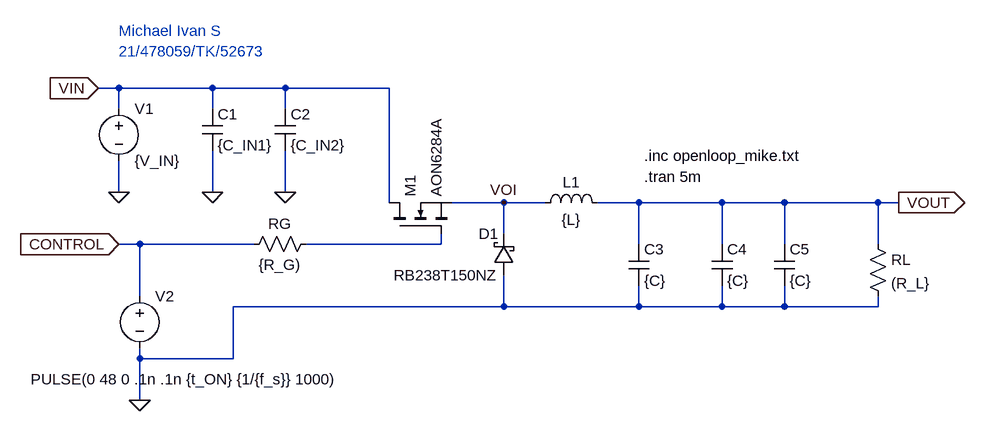
[diagram p0: schematic openloop_mike.asc]
openloop_mike.asc, the LTspice schematic file:
Version 4
SHEET 1 1372 788
WIRE 48 288 16 288
WIRE 192 288 48 288
WIRE 304 288 192 288
WIRE 464 288 304 288
WIRE 48 320 48 288
WIRE 192 320 192 288
WIRE 304 320 304 288
WIRE 48 448 48 400
WIRE 192 448 192 384
WIRE 304 448 304 384
WIRE 464 464 464 288
WIRE 640 464 560 464
WIRE 704 464 640 464
WIRE 848 464 784 464
WIRE 976 464 848 464
WIRE 1072 464 976 464
WIRE 1216 464 1072 464
WIRE 1248 464 1216 464
WIRE 640 512 640 464
WIRE 80 528 48 528
WIRE 256 528 80 528
WIRE 544 528 544 512
WIRE 544 528 336 528
WIRE 848 528 848 464
WIRE 976 528 976 464
WIRE 1072 528 1072 464
WIRE 1216 528 1216 464
WIRE 80 608 80 528
WIRE 640 624 640 576
WIRE 640 624 224 624
WIRE 848 624 848 592
WIRE 848 624 640 624
WIRE 976 624 976 592
WIRE 976 624 848 624
WIRE 1072 624 1072 592
WIRE 1072 624 976 624
WIRE 1216 624 1216 608
WIRE 1216 624 1072 624
WIRE 80 704 80 688
WIRE 224 704 224 624
WIRE 224 704 80 704
WIRE 80 768 80 704
FLAG 80 768 0
FLAG 48 448 0
FLAG 192 448 0
FLAG 304 448 0
FLAG 16 288 VIN
IOPIN 16 288 In
FLAG 48 528 CONTROL
IOPIN 48 528 In
FLAG 1248 464 VOUT
IOPIN 1248 464 Out
FLAG 640 464 VOI
SYMBOL nmos 464 512 R270
SYMATTR InstName M1
SYMATTR Value AON6284A
SYMBOL voltage 48 304 R0
WINDOW 123 0 0 Left 0
WINDOW 39 0 0 Left 0
SYMATTR InstName V1
SYMATTR Value {V_IN}
SYMBOL cap 176 320 R0
SYMATTR InstName C1
SYMATTR Value {C_IN1}
SYMBOL cap 288 320 R0
SYMATTR InstName C2
SYMATTR Value {C_IN2}
SYMBOL res 240 544 R270
WINDOW 0 32 56 VTop 2
WINDOW 3 0 56 VBottom 2
SYMATTR InstName RG
SYMATTR Value {R_G)
SYMBOL voltage 80 592 R0
WINDOW 3 -168 144 Left 2
WINDOW 123 0 0 Left 0
WINDOW 39 0 0 Left 0
SYMATTR Value PULSE(0 48 0 .1n .1n {t_ON} {1/{f_s}} 1000)
SYMATTR InstName V2
SYMBOL ind 688 480 R270
WINDOW 0 32 56 VTop 2
WINDOW 3 5 56 VBottom 2
SYMATTR InstName L1
SYMATTR Value {L}
SYMBOL cap 832 528 R0
SYMATTR InstName C3
SYMATTR Value {C}
SYMBOL cap 960 528 R0
SYMATTR InstName C4
SYMATTR Value {C}
SYMBOL cap 1056 528 R0
SYMATTR InstName C5
SYMATTR Value {C}
SYMBOL res 1200 512 R0
SYMATTR InstName RL
SYMATTR Value (R_L}
SYMBOL schottky 656 576 R180
WINDOW 0 24 64 Left 2
WINDOW 3 24 0 Left 2
SYMATTR InstName D1
SYMATTR Value RB238T150NZ
TEXT 48 200 Left 2 ;Michael Ivan S\n21/478059/TK/52673
TEXT 856 424 Left 2 !.tran 5m
TEXT 856 392 Left 2 !.inc openloop_mike.txt

The netlist it stands for:
* openloop_mike.asc
M1 VIN N001 VOI VOI AON6284A
V1 VIN 0 {V_IN}
C1 VIN 0 {C_IN1}
C2 VIN 0 {C_IN2}
RG CONTROL N001 {R_G)
V2 CONTROL 0 PULSE(0 48 0 .1n .1n {t_ON} {1/{f_s}} 1000)
L1 VOI VOUT {L}
C3 VOUT 0 {C}
C4 VOUT 0 {C}
C5 VOUT 0 {C}
RL VOUT 0 (R_L}
D1 0 VOI RB238T150NZ
.model D D
.lib standard.dio
.model NMOS NMOS
.model PMOS PMOS
.lib standard.mos
* Michael Ivan S
* 21/478059/TK/52673
.tran 5m
.inc openloop_mike.txt
.backanno
.end